# Altium schematic sheet CAN.SchDoc
size A4
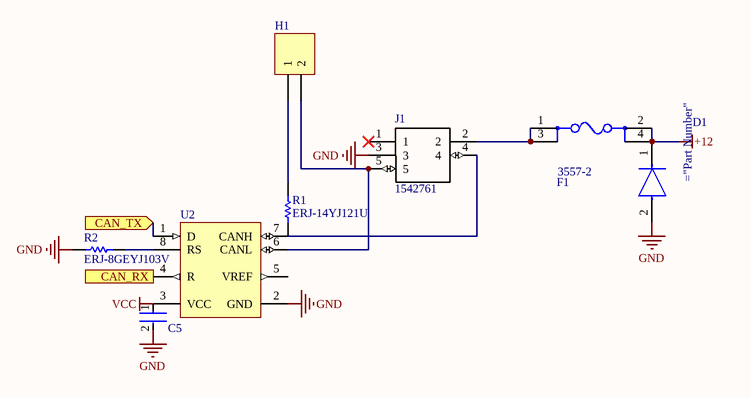
[diagram p0: CAN.SchDoc]

## Parts
C5  C0603C104K5RACTU  [Kemet_C0603_IPC_A]  (value not drawn)
D1  S1J-13-F  [Diodes_SMA_0]  (value not drawn)
F1  3557-2  [Keystone_3557-2_0]  (value not drawn)
H1  Header 0  [HDR1X2]  (value not drawn)
J1  1542761  [1542761]
R1  ERJ-14YJ121U  [RESC3225X70X50ML20T20]
R2  ERJ-8GEYJ103V  [RESC3216X70X50NL05T20]
U2  SN65HVD230D  [D0008A_M]  (value not drawn)

## Ports
CAN_RX (out), CAN_TX (in)

## Nets
+12: D1.1(C) F1.2 F1.4
GND: C5.2 D1.2(A) J1.3 R2.2 U2.2(GND)
VCC: C5.1 U2.3(VCC)
CAN_RX: U2.4(R) ; port CAN_RX
CAN_TX: U2.1(D) ; port CAN_TX
NetF1_1: F1.1 F1.3 J1.2
NetH1_1: H1.1 R1.2
NetH1_2: H1.2 J1.5 U2.6(CANL)
NetJ1_4: J1.4 R1.1 U2.7(CANH)
NetR2_1: R2.1 U2.8(RS)

Not connected (* = marked no-connect by the designer): J1 1*; U2 5(VREF)

## Library data of the parts
F1 = 3557-2: 3557-2 Automotive Fuse Holder Through Hole; Part Number: 3557-2
H1 = Header 2: Header, 2-Pin; LatestRevisionDate: 17-Jul-2002; LatestRevisionNote: Re-released for DXP Platform.; Publisher: Altium Limited
J1 = 1542761: Connector; Manufacturer_Name: Phoenix Contact; Allied_Number: 70170366; Datasheet Link: https://media.digikey.com/PDF/Data%20Sheets/Phoenix%20Contact%20PDFs/1542761.pdf; Height: 18mm; Manufacturer_Part_Number: 1542761; Mouser Part Number: 651-1542761; Mouser Price/Stock: https://www.mouser.com/Search/Refine.aspx?Keyword=651-1542761; RS Part Number: 8025583; RS Price/Stock: http://uk.rs-online.com/web/p/products/8025583; Allied Price/Stock: https://www.alliedelec.com/phoenixcontact-1542761/70170366/
R1 = CMP-2005-03490-1: 120Ohm; Manufacturer: Panasonic; Part Number: ERJ-14YJ121U
R2 = CMP-2003-00545-1: 10k; Manufacturer: Panasonic; Part Number: ERJ-8GEYJ103V
U2 = CMP-0315-00046-3: CAN Bus Transceiver, 3.3 V, -40 to 85 degC, 8-Pin SOIC (D), Green (RoHS & no Sb/Br), Tube; Supply Voltage Min: 3 V; Supply Voltage Max: 3.6 V; PartNumber: SN65HVD230D; ComponentLink2URL: http://www.ti.com/general/docs/lit/getliterature.tsp?genericGeneric Part Number=SN65HVD230&fileType=pdf; DatasheetVersion: SLOS346N; Generic Part Number: SN65HVD230; Packing: Tube; Temperature Min: -40 degC; Temperature Max: 85 degC; ComponentLink1Description: Manufacturer URL; Mounting Technology: Surface Mount; RoHS: TRUE; ComponentLink1URL: http://www.ti.com/; ComponentLink2Description: Datasheet; PackageDescription: 8-Pin Plastic Small Outline, Body 4.9 x 3.9 mm, Pitch 1.27 mm